# EasyEDA Pro project ProPrj_transboard.epro

# Schematic transboard
Board Name: transboard; Create Date: 2024-11-09; Page Name: transboard; Project Name: transboard; Schematic Name: transboard; Update Date: 2024-11-09; Address1: *; Address2: *; Address3: *; Address4: *; Application_BuildNumber: *; ApprovedBy: *; Author: *; CheckedBy: *; CompanyName: *; CurrentDate: *; CurrentTime: *; Date: *; DocumentFullPathAndName: *; DocumentName: *; DocumentNumber: *; DrawnBy: *; Engineer: *; ImagePath: *; ModifiedDate: *; Organization: *; ProjectName: *; Revision: *; Rule: *; SheetNumber: 1; SheetTotal: 1; Time: *; Title: *
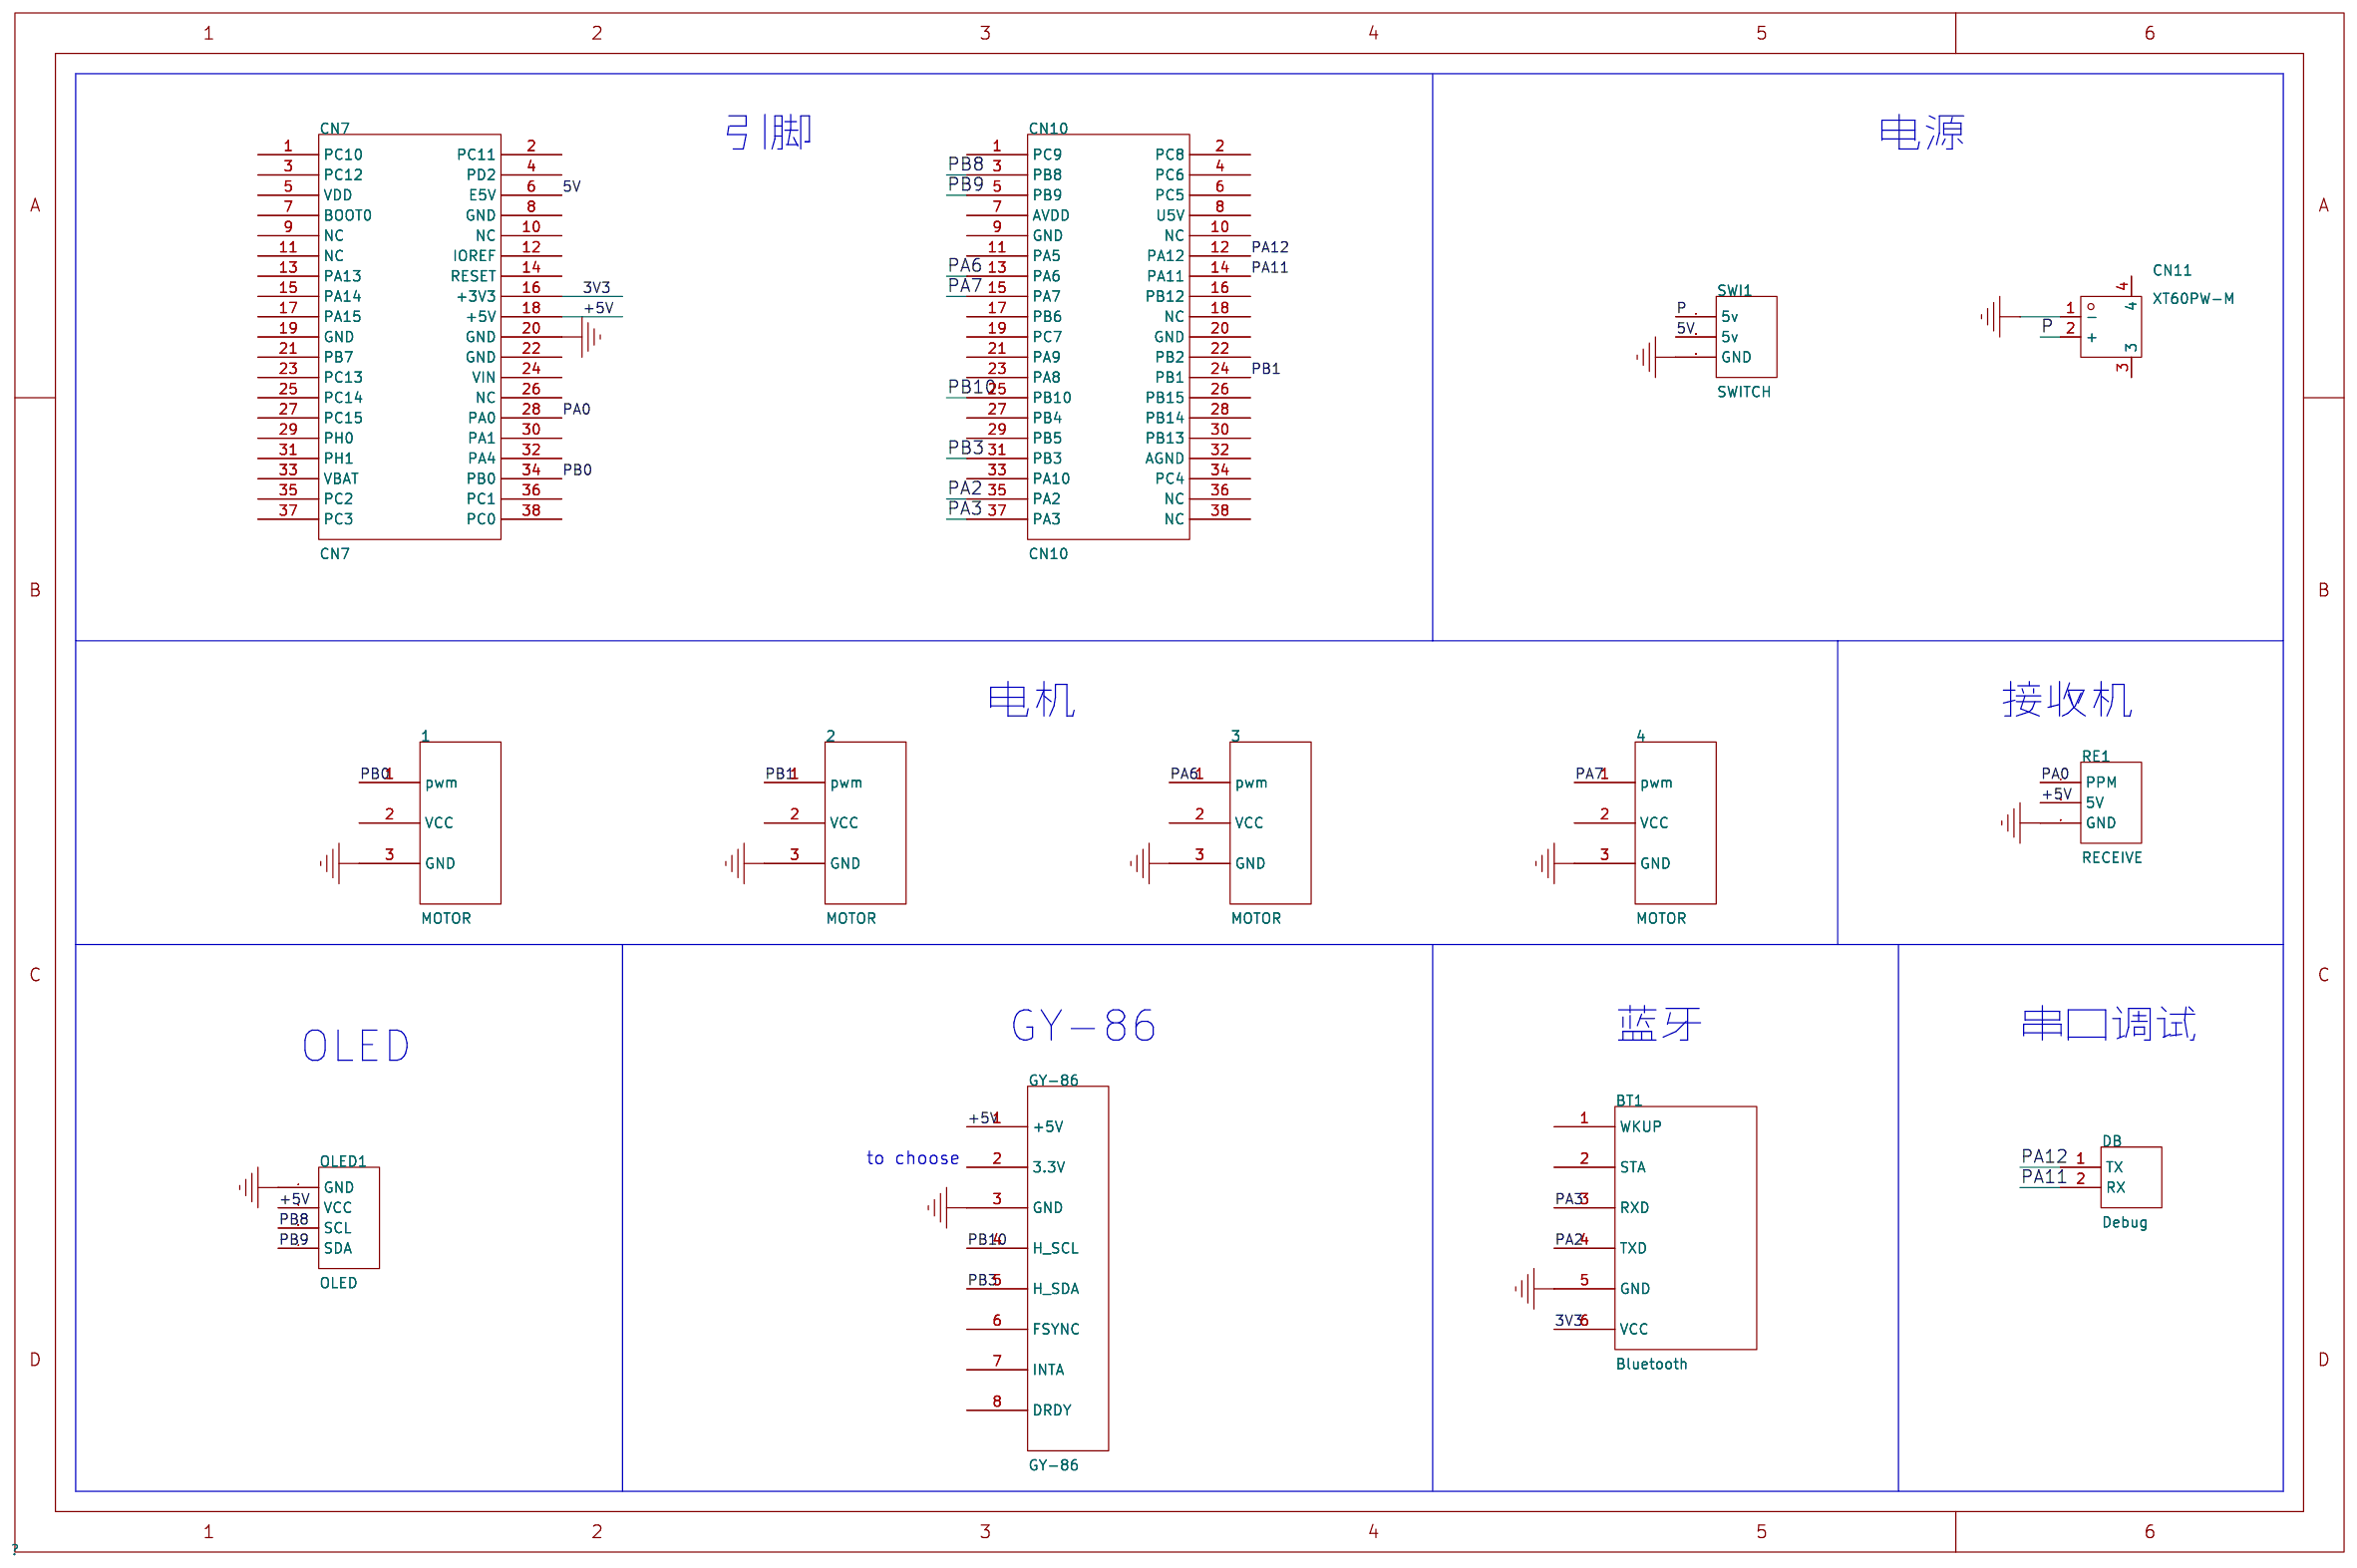
[diagram p0: schematic sheet]

## Parts
1  MOTOR  [HDR-F-2.54_1X3]
2  MOTOR  [HDR-F-2.54_1X3]
3  MOTOR  [HDR-F-2.54_1X3]
4  MOTOR  [HDR-F-2.54_1X3]
BT1  Bluetooth  [HDR-F-2.54_1X6]
CN7  CN7  [HDR-TH_38P-P2.54-V-F-R2-C19-S2.54]
CN10  CN10  [HDR-TH_38P-P2.54-V-F-R2-C19-S2.54]
CN11  XT60PW-M  [CONN-TH_XT60PW-M]
DB  Debug  [HDR-F-2.54_1X2]
GY-86  GY-86  [HDR-F-2.54_1X8]
OLED1  OLED  [HDR-F-2.54_1X4]
RE1  RECEIVE  [HDR-F-2.54_1X3]
SWI1  SWITCH  [HDR-F-2.54_1X3]

## Library data of the parts
1-4 = MOTOR: Design Item ID: M; Library Name: Free Documents
BT1 = Bluetooth: Library Name: Free Documents
CN7 = CN7: Library Name: Free Documents
CN10 = CN10: Library Name: Free Documents
CN11 = XT60PW-M: 类别:-;类型1:-;; LCSC Part Name: AMASS(艾迈斯)航模插头xt60连接器150公母对接pw锂电池公头 板插卧式XT60PW-M; Supplier Part: C98732; Manufacturer: AMASS(艾迈斯); JLCPCB Part Class: 扩展库; Datasheet: https://atta.szlcsc.com/upload/public/pdf/source/20240118/44A3DCFF53BE25DC65378AFFB21277A4.pdf; Supplier: LCSC; Brand: 艾迈斯; Type: 卧式插头; Colour: 黄色; InterfaceType: 公头
DB = Debug: Header, 2-Pin; LatestRevisionDate: 17-Jul-2002; LatestRevisionNote: Re-released for DXP Platform.; Publisher: Altium Limited; Design Item ID: Header 2; Library Name: Miscellaneous Connectors
GY-86 = GY-86: Library Name: 转接板lib
OLED1 = OLED: Header, 4-Pin; LatestRevisionDate: 17-Jul-2002; LatestRevisionNote: Re-released for DXP Platform.; Publisher: Altium Limited; Design Item ID: Header 4; Library Name: Free Documents
RE1 = RECEIVE: Header, 3-Pin; LatestRevisionDate: 17-Jul-2002; LatestRevisionNote: Re-released for DXP Platform.; Publisher: Altium Limited; Design Item ID: Header 3; Library Name: Free Documents
SWI1 = SWITCH: Header, 3-Pin; LatestRevisionDate: 17-Jul-2002; LatestRevisionNote: Re-released for DXP Platform.; Publisher: Altium Limited; Design Item ID: Header 3_1; Library Name: Free Documents

## Nets
3V3: BT1.6(VCC) CN7.16(+3V3)
5V: CN7.6(E5V) SWI1.2(5v)
+5V: CN7.18(+5V) GY-86.1(+5V) OLED1.2(VCC) RE1.2(5V)
GND: 1.3(GND) 2.3(GND) 3.3(GND) 4.3(GND) BT1.5(GND) CN7.20(GND) CN11.1(-) GY-86.3(GND) OLED1.1(GND) RE1.3(GND) SWI1.3(GND)
P: CN11.2(+) SWI1.1(5v)
PA0: CN7.28(PA0) RE1.1(PPM)
PA2: BT1.4(TXD) CN10.35(PA2)
PA3: BT1.3(RXD) CN10.37(PA3)
PA6: 3.1(pwm) CN10.13(PA6)
PA7: 4.1(pwm) CN10.15(PA7)
PA11: CN10.14(PA11) DB.2(RX)
PA12: CN10.12(PA12) DB.1(TX)
PB0: 1.1(pwm) CN7.34(PB0)
PB1: 2.1(pwm) CN10.24(PB1)
PB3: CN10.31(PB3) GY-86.5(H_SDA)
PB8: CN10.3(PB8) OLED1.3(SCL)
PB9: CN10.5(PB9) OLED1.4(SDA)
PB10: CN10.25(PB10) GY-86.4(H_SCL)

Not connected (* = marked no-connect by the designer): 1 2(VCC); 2 2(VCC); 3 2(VCC); 4 2(VCC); BT1 1(WKUP) 2(STA); CN7 1(PC10) 2(PC11) 3(PC12) 4(PD2) 5(VDD) 7(BOOT0) 8(GND) 9(NC) 10(NC) 11(NC) 12(IOREF) 13(PA13) 14(RESET) 15(PA14) 17(PA15) 19(GND) 21(PB7) 22(GND) 23(PC13) 24(VIN) 25(PC14) 26(NC) 27(PC15) 29(PH0) 30(PA1) 31(PH1) 32(PA4) 33(VBAT) 35(PC2) 36(PC1) 37(PC3) 38(PC0); CN10 1(PC9) 2(PC8) 4(PC6) 6(PC5) 7(AVDD) 8(U5V) 9(GND) 10(NC) 11(PA5) 16(PB12) 17(PB6) 18(NC) 19(PC7) 20(GND) 21(PA9) 22(PB2) 23(PA8) 26(PB15) 27(PB4) 28(PB14) 29(PB5) 30(PB13) 32(AGND) 33(PA10) 34(PC4) 36(NC) 38(NC); CN11 3 4; GY-86 2(3.3V) 6(FSYNC) 7(INTA) 8(DRDY)

## Notes on the sheet
- 引脚
- 电源
- 电机
- 接收机
- GY-86
- 蓝牙
- 串口调试
- OLED
- to choose

# Board transboardv2.1
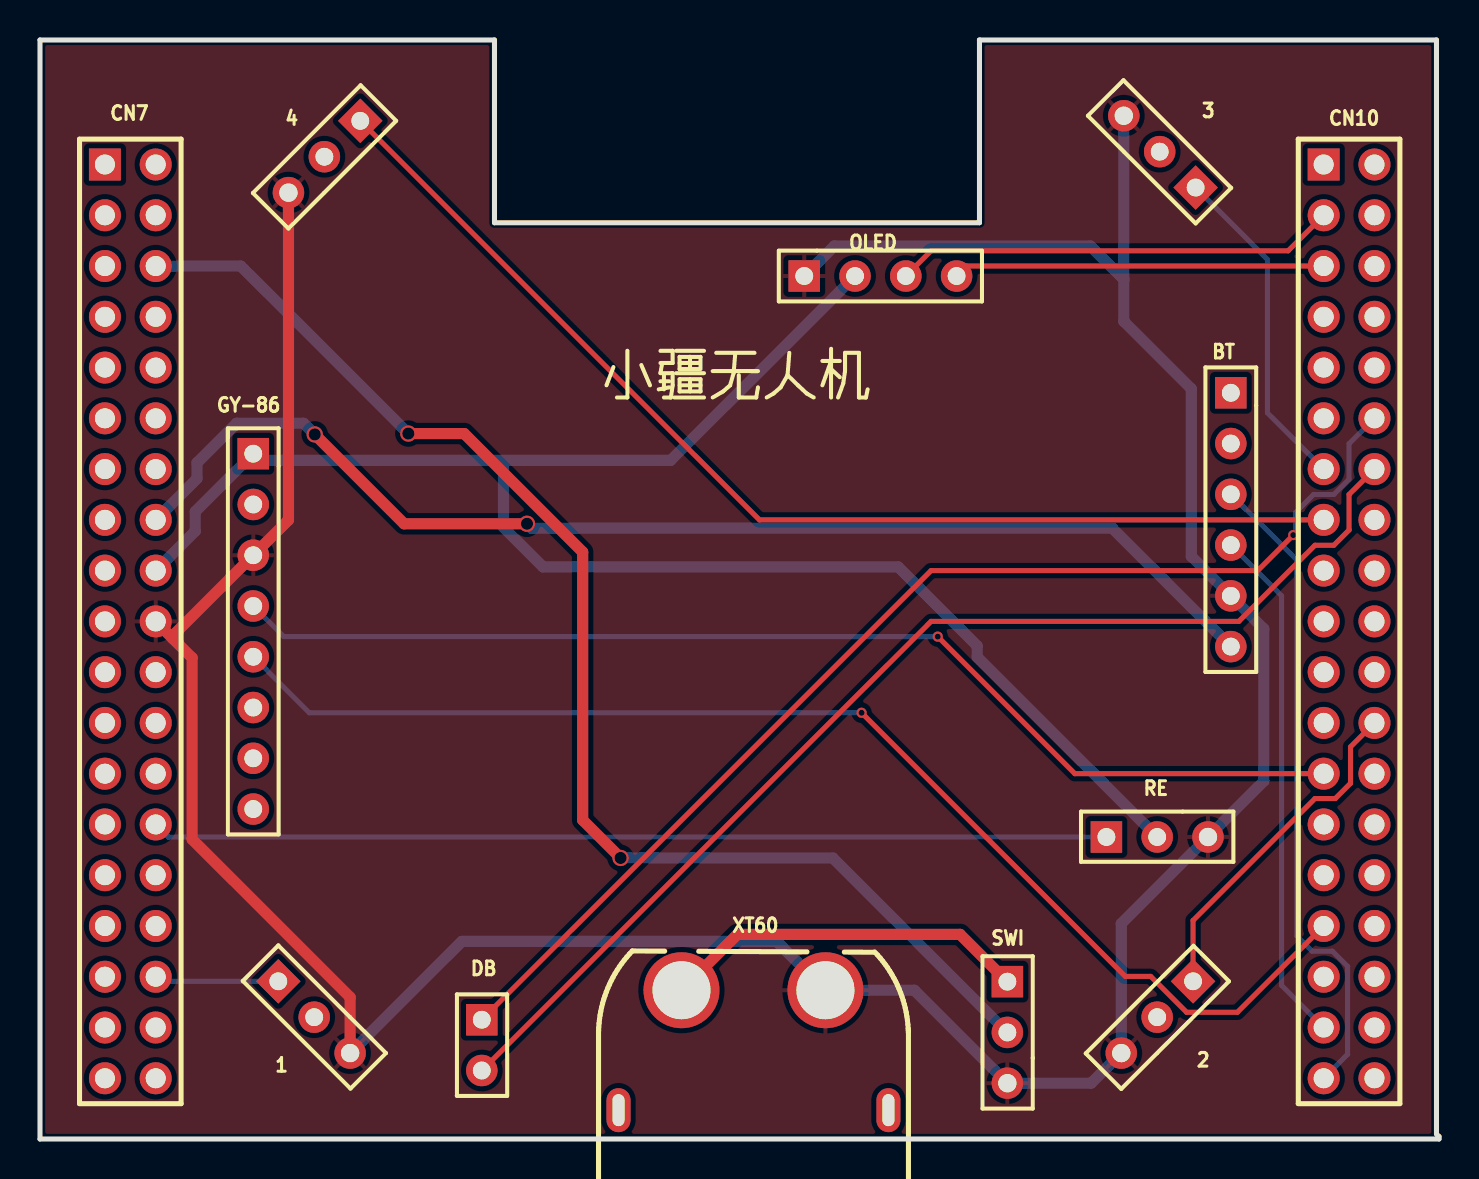
[diagram p1: board, top side]
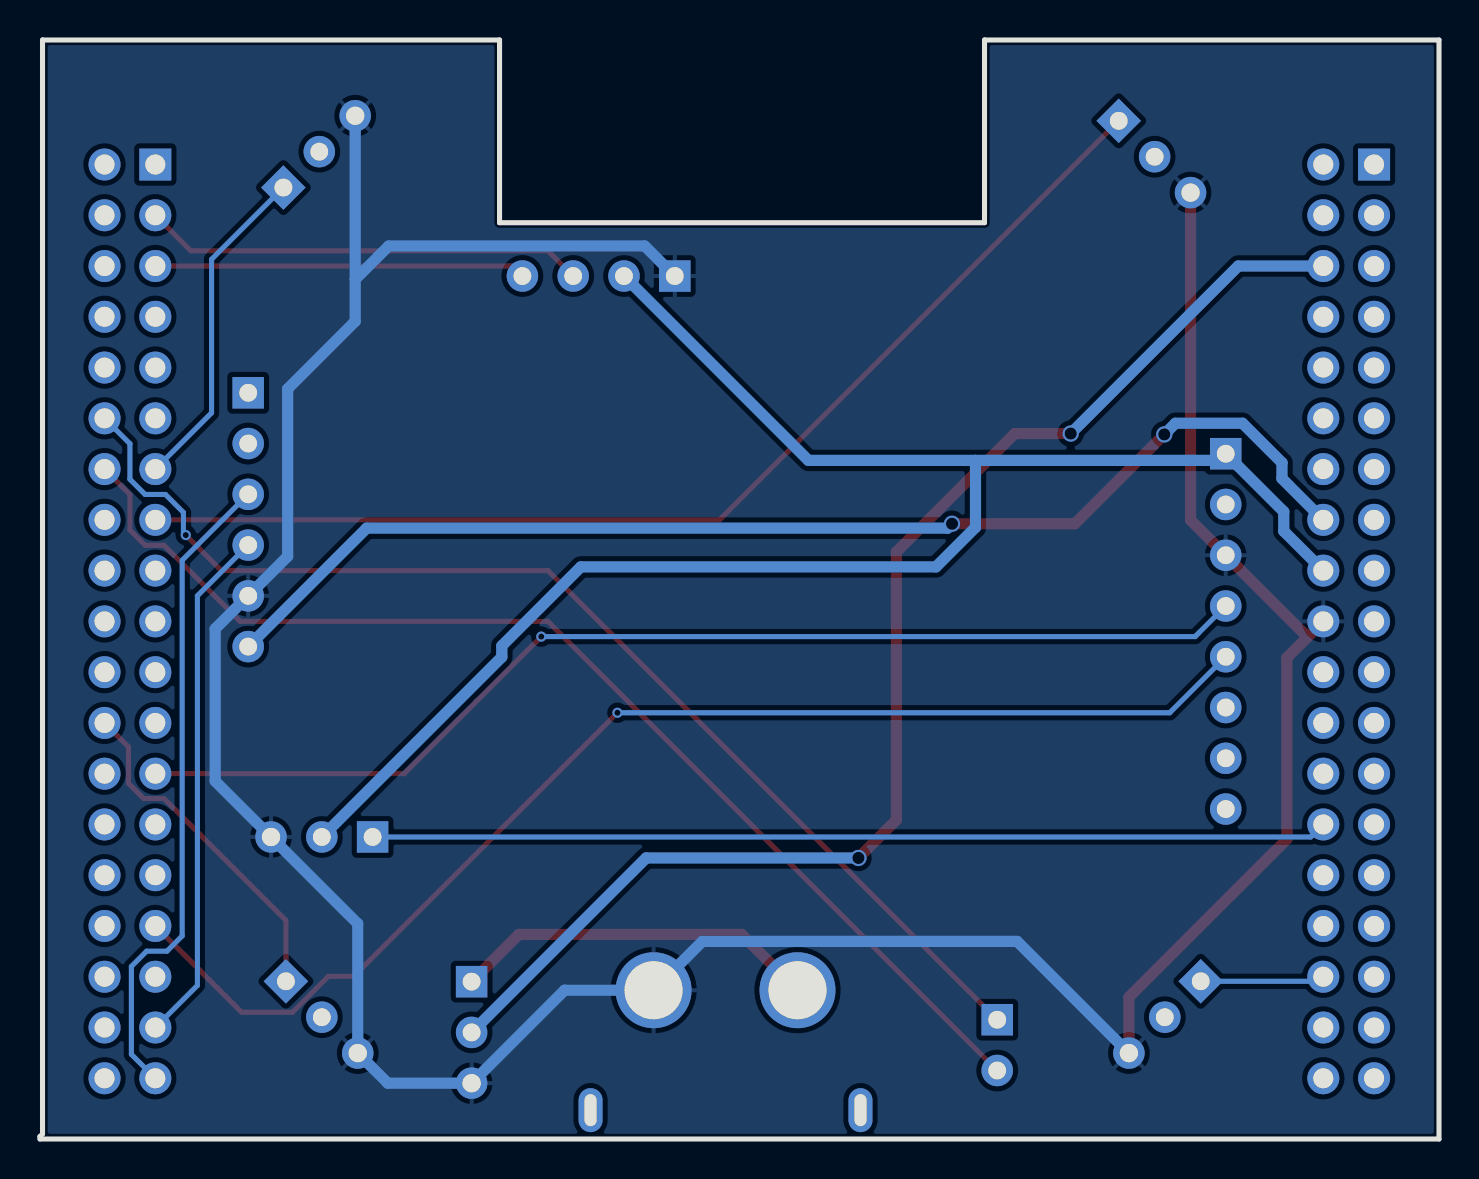
[diagram p2: board, bottom side, seen from below]

Outline 69.98 x 54.99 mm; copper layers: Top Layer, Bottom Layer. Coordinates in mm from the lower left corner of the outline.
Outline path: 0,54.99 0,0 69.98,0 69.98,0.13 69.85,0.25 69.85,54.99 46.99,54.99 46.99,45.85 22.73,45.85 22.73,54.99 0,54.99
Stack: Top Layer 0.035mm / Dielectric1 1.51mm FR4 er 4.5 / Bottom Layer 0.035mm

## Design rules (mm)
template: 自定义配置
spacing copperThickness1oz (default): track to track 0.254, other pairs 0.152 to 0.3
spacing copperThickness2oz: track to track 0.254, other pairs 0.152 to 0.3
track width copperThickness1oz (default): min 0.127, default 0.254, max 2.54
track width copperThickness2oz: min 0.203, default 0.559, max 2.54
differential pair differentialPair (default): width min 0.127, default 0.254, max 2.54; gap min 0.152, default 0.152
via viaSize (default): diameter min 0.5, default 0.508, max 10; hole min 0.3, default 0.305, max 6.299
via viaSize2: diameter min 0.5, default 0.813, max 10; hole min 0.3, default 0.61, max 6.299
net GND uses copperThickness2oz, viaSize2
net 3V3 uses copperThickness2oz, viaSize2
net 5V uses copperThickness2oz, viaSize2
net P uses copperThickness2oz, viaSize2
net +5V uses copperThickness2oz, viaSize2

## Placement (name value [footprint] x y rotation side)
1  MOTOR  [HDR-F-2.54_1X3]  13.72 6.1 315 top
2  MOTOR  [HDR-F-2.54_1X3]  55.88 6.1 225 top
3  MOTOR  [HDR-F-2.54_1X3]  56.01 49.4 135 top
4  MOTOR  [HDR-F-2.54_1X3]  14.22 49.15 225 top
BT  Bluetooth  [HDR-F-2.54_1X6]  59.56 32.26 270 top
CN7  CN7  [HDR-TH_38P-P2.54-V-F-R2-C19-S2.54]  4.52 25.9 270 top
CN10  CN10  [HDR-TH_38P-P2.54-V-F-R2-C19-S2.54]  65.48 25.9 270 top
DB  Debug  [HDR-F-2.54_1X2]  22.1 4.7 270 top
GY-86  GY-86  [HDR-F-2.54_1X8]  10.67 26.67 270 top
OLED  OLED  [HDR-F-2.54_1X4]  42.04 43.18 0 top
RE  RECEIVE  [HDR-F-2.54_1X3]  55.88 15.11 0 top
SWI  SWITCH  [HDR-F-2.54_1X3]  48.39 5.33 270 top
XT60  XT60PW-M  [CONN-TH_XT60PW-M]  35.69 4.44 90 top

## Footprints (pads in the part's own frame, mm; a bottom-side part is the same pattern mirrored in y, then rotated)
CONN-TH_XT60PW-M
  round 3.8 hole 2.9: 1(3,-3.6) 2(3,3.6)
  oval 2.2x1.2 hole 1.6x0.6: 3(-3,6.75) 4(-3,-6.75)
HDR-F-2.54_1X2
  rect 1.575x1.575 hole 0.889: 1(-1.27,0)
  round 1.575 hole 0.889: 2(1.27,0)
HDR-F-2.54_1X3
  rect 1.575x1.575 hole 0.889: 1(-2.54,0)
  round 1.575 hole 0.889: 2(0,0)
  round 1.575 hole 0.914: 3(2.54,0)
HDR-F-2.54_1X4
  rect 1.575x1.575 hole 0.889: 1(-3.81,0)
  round 1.575 hole 0.889: 2(-1.27,0) 3(1.27,0) 4(3.81,0)
HDR-F-2.54_1X6
  rect 1.575x1.575 hole 0.889: 1(-5.08,0)
  round 1.575 hole 0.889: 2(-2.54,0) 3(0,0) 4(2.54,0) 5(5.08,0) 6(7.62,0)
HDR-F-2.54_1X8
  rect 1.575x1.575 hole 0.889: 1(-7.62,0)
  round 1.575 hole 0.889: 2(-5.08,0) 3(-2.54,0) 4(0,0) 5(2.54,0) 6(5.08,0) 7(7.62,0) 8(10.16,0)
HDR-TH_38P-P2.54-V-F-R2-C19-S2.54
  rect 1.6x1.6 hole 1: 1(-22.86,-1.27)
  round 1.6 hole 1: 2(-22.86,1.27) 3(-20.32,-1.27) 4(-20.32,1.27) 5(-17.78,-1.27) 6(-17.78,1.27) 7(-15.24,-1.27) 8(-15.24,1.27) 9(-12.7,-1.27) 10(-12.7,1.27) 11(-10.16,-1.27) 12(-10.16,1.27) 13(-7.62,-1.27) 14(-7.62,1.27) 15(-5.08,-1.27) 16(-5.08,1.27) 17(-2.54,-1.27) 18(-2.54,1.27) 19(0,-1.27) 20(0,1.27) 21(2.54,-1.27) 22(2.54,1.27) 23(5.08,-1.27) 24(5.08,1.27) 25(7.62,-1.27) 26(7.62,1.27) 27(10.16,-1.27) 28(10.16,1.27) 29(12.7,-1.27) 30(12.7,1.27) 31(15.24,-1.27) 32(15.24,1.27) 33(17.78,-1.27) 34(17.78,1.27) 35(20.32,-1.27) 36(20.32,1.27) 37(22.86,-1.27) 38(22.86,1.27)

## Nets
3V3: BT.6 CN7.16
5V: CN7.6 SWI.2
+5V: CN7.18 GY-86.1 OLED.2 RE.2
GND: 1.3 2.3 3.3 4.3 BT.5 CN7.20 GY-86.3 OLED.1 RE.3 SWI.3 XT60.1
P: SWI.1 XT60.2
PA0: CN7.28 RE.1
PA2: BT.4 CN10.35
PA3: BT.3 CN10.37
PA6: 3.1 CN10.13
PA7: 4.1 CN10.15
PA11: CN10.14 DB.2
PA12: CN10.12 DB.1
PB0: 1.1 CN7.34
PB1: 2.1 CN10.24
PB3: CN10.31 GY-86.5
PB8: CN10.3 OLED.3
PB9: CN10.5 OLED.4
PB10: CN10.25 GY-86.4

Pads without a net: 1 2; 2 2; 3 2; 4 2; BT 1 2; CN7 1 2 3 4 5 7 8 9 10 11 12 13 14 15 17 19 21 22 23 24 25 26 27 29 30 31 32 33 35 36 37 38; CN10 1 2 4 6 7 8 9 10 11 16 17 18 19 20 21 22 23 26 27 28 29 30 32 33 34 36 38; GY-86 2 6 7 8; XT60 3 4

## Via types
v1: diameter 0.813, hole 0.61, Top Layer to Bottom Layer, 4 vias
v2: diameter 0.508, hole 0.305, Top Layer to Bottom Layer, 3 vias

## Routing (per net, layer and track width the routed paths; a pad name or vN(x,y) marks a point on that pad's centre or on a via; arc(x,y) is an arc through that point)
3V3: length 60.9
  Top Layer w0.559: v1(13.74,35.25) 18.21,30.78 v1(24.36,30.78)
  Bottom Layer w0.559: v1(13.74,35.25) 13.18,35.81 9.83,35.81 7.85,33.84 7.85,33.05 CN7.16 ; v1(24.36,30.78) 24.58,30.56 53.64,30.56 BT.6
5V: length 66.3
  Top Layer w0.559: v1(29.04,14.06) 27.14,15.96 27.14,29.37 21.22,35.3 v1(18.42,35.3)
  Bottom Layer w0.559: v1(29.04,14.06) 39.66,14.06 SWI.2 ; CN7.6 10.04,43.68 v1(18.42,35.3)
+5V: length 84.9
  Bottom Layer w0.559: 23.19,33.95 31.54,33.95 OLED.2 ; 23.19,33.95 10.33,33.95 ; 23.19,33.95 23.19,30.6 25.16,28.63 42.93,28.63 46.88,24.67 46.88,24.12 RE.2 ; 10.33,33.95 7.76,31.39 7.76,30.42 CN7.18 ; 10.33,33.95 GY-86.1
GND: length 164.8
  Top Layer w0.559: 6.62,25.07 CN7.20 ; 6.62,25.07 7.61,24.08 7.61,15 15.51,7.09 1.3 ; 6.62,25.07 6.62,25.16 GY-86.3 12.43,30.97 4.3
  Bottom Layer w0.559: 1.3 21.1,9.89 36.84,9.89 XT60.1 43.74,7.44 SWI.3 52.58,2.79 2.3 54.08,10.78 RE.3 61.21,17.91 61.21,25.53 BT.5 57.59,29.15 57.59,37.54 54.21,40.91 54.21,43.01 ; 54.21,43.01 52.53,44.68 39.73,44.68 OLED.1 ; 54.21,43.01 54.21,51.2
P: length 18.4
  Top Layer w0.559: SWI.1 46.02,10.24 34.88,10.24 XT60.2
PA0: length 47.8
  Bottom Layer w0.254: RE.1 6.42,15.11 CN7.28
PA2: length 26.1
  Bottom Layer w0.254: BT.4 62.1,27.18 62.1,7.69 CN10.35
PA3: length 32.7
  Bottom Layer w0.254: CN10.37 65.41,4.24 65.41,8.64 64.64,9.4 63.63,9.4 62.87,10.16 62.87,28.96 BT.3
PA6: length 16.7
  Bottom Layer w0.254: CN10.13 61.4,36.33 61.4,44.02 57.8,47.61
PA7: length 56.5
  Top Layer w0.254: CN10.15 35.99,30.98 16.02,50.94
PA11: length 58.2
  Top Layer w0.254: DB.2 44.57,25.9 59.97,25.9 63.78,29.71 64.72,29.71 65.48,30.47 65.48,32.25 CN10.14
PA12: length 58.8
  Top Layer w0.254: v2(62.68,30.22) 60.91,28.44 44.57,28.44 DB.1
  Bottom Layer w0.254: CN10.12 65.48,34.79 65.48,33.01 64.72,32.25 63.7,32.25 62.8,31.35 62.8,30.34 v2(62.68,30.22)
PB0: length 6.2
  Bottom Layer w0.254: CN7.34 6.02,7.89 1.1
PB1: length 17.3
  Top Layer w0.254: CN10.24 65.55,19.62 65.55,17.8 64.79,17.04 63.77,17.04 57.68,10.94 2.1
PB3: length 62.7
  Top Layer w0.254: CN10.31 59.89,6.34 57.35,6.34 55.55,8.14 54.28,8.14 v2(41.09,21.33)
  Bottom Layer w0.254: v2(41.09,21.33) 13.47,21.33 GY-86.5
PB8: length 22.2
  Top Layer w0.254: CN10.3 62.43,44.44 44.57,44.44 OLED.3
PB9: length 18.6
  Top Layer w0.254: OLED.4 46.35,43.68 CN10.5
PB10: length 57
  Top Layer w0.254: CN10.25 51.76,18.28 v2(44.9,25.14)
  Bottom Layer w0.254: v2(44.9,25.14) 12.2,25.14 GY-86.4

## Copper pours and planes (outline as drawn; the poured copper is in the pictures)
GND on Top Layer: 22.99,55.37 31.99,46.37 46.99,46.37 46.88,46.48 46.61,46.48 46.61,54.99 69.6,54.99 69.98,55.37 69.98,0 0,0 -0.13,0.13 -0.13,55.37
GND on Bottom Layer: -0.51,57.91 72.39,57.91 72.9,58.42 72.9,-0.76 73.41,-1.27 -1.65,-1.27 -1.65,58.17 -1.91,58.42 -1.02,58.42

## Text on the board
Top Silkscreen Layer: 小疆无人机
